# EAGLE design 8335-breakout (EAGLE 8.4.0)
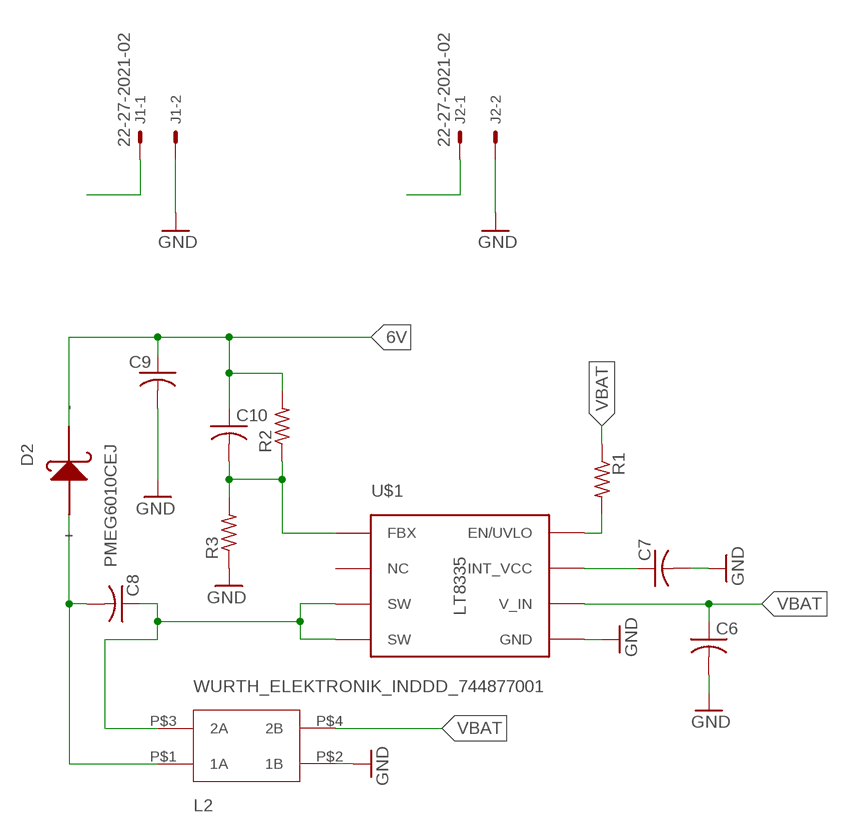
[diagram p0: schematic, sheet 1]

## Parts
C6  C-USC0805  [C0805]
C7  C-USC0805  [C0805]
C8  C-USC0805  [C0805]
C9  C-USC0805  [C0805]
C10  C-USC0805  [C0805]
D2  PMEG6010CEJ  [SC-90]
J1  22-27-2021-02  [6410-02]
J2  22-27-2021-02  [6410-02]
L2  WURTH_ELEKTRONIK_INDDD_744877001  [WURTH_ELEKTRONIK_INDDD_744877001]
R1  R-US_R0805  [R0805]
R2  R-US_R0805  [R0805]
R3  R-US_R0805  [R0805]
U$1  LT8335  [DDB]

## Nets
6V: C9.1 C10.1 D2.P$2(-) J1.1 R2.2
EN_UVLO1: R1.2 U$1.P$8(EN/UVLO)
FBX1: C10.2 R2.1 R3.2 U$1.P$1(FBX)
GND: C6.2 C7.2 C9.2 J1.2 J2.2 L2.P$2(1B) R3.1 U$1.GND U$1.P$5(GND)
INT_VCC1: C7.1 U$1.P$7(INT_VCC)
N$1: C8.2 D2.P$1(+) L2.P$1(1A)
SW1: C8.1 L2.P$3(2A) U$1.P$3(SW) U$1.P$4(SW)
VBAT: C6.1 J2.1 L2.P$4(2B) R1.1 U$1.P$6(V_IN)
Unconnected: U$1.P$2(NC)

## Library data of the parts
C6-C10 = rcl:C-US: CAPACITOR, American symbol
D2 = DubSat1 Components:PMEG6010CEJ
J1 J2 = con-molex:22-?-02: CONNECTOR wire to board 2.54 mm (.1 inch) pitch header; OC_FARNELL: unknown; OC_NEWARK: unknown
L2 = DubSat1 Components:WURTH_ELEKTRONIK_INDDD_744877001
R1-R3 = rcl:R-US_: RESISTOR, American symbol
U$1 = DubSat1 Components:LT8335

## Net classes
0 default: width 0.254 mm, drill 0.254 mm, clearance 0.152 mm

## Board
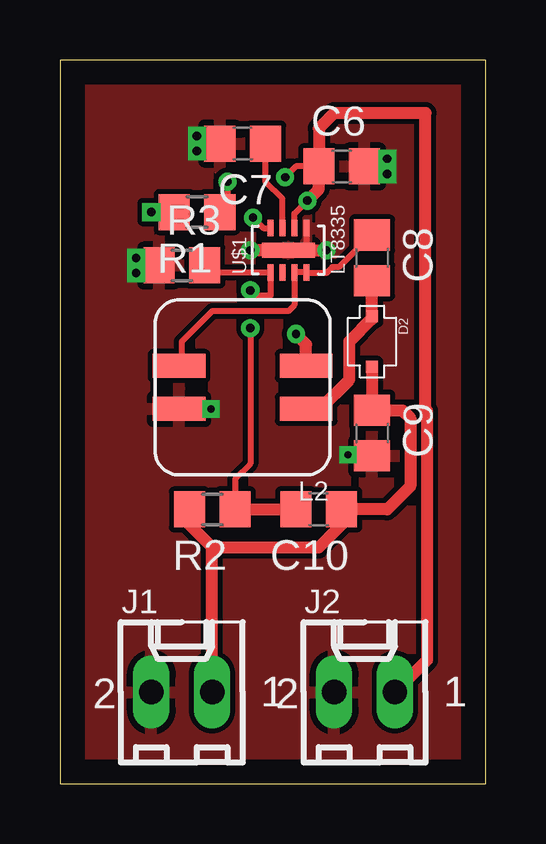
[diagram p1: board, top side]
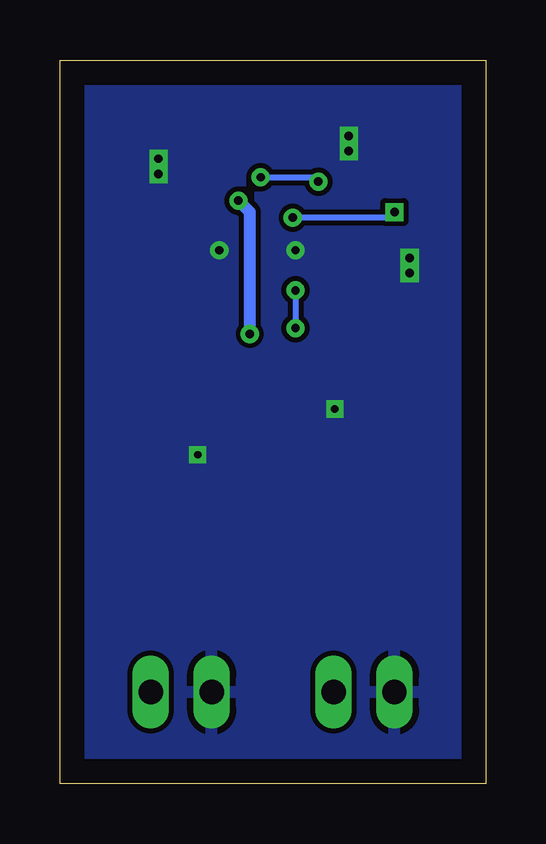
[diagram p2: board, bottom side, seen from below]

Size 17.76 x 30.15 mm. Coordinates in mm from the lower left corner, seen from the top.
Outline: 0,0 17.76,0 17.76,30.15 0,30.15 0,0
Copper layers (1*16): Top 0.035mm / dielectric 1.5mm / Bottom 0.035mm
Design rules "default *": minimum track width 6mil, minimum drill 0.35mm, track to track 8mil, track to pad 8mil, pad to pad 8mil, via to via 8mil, smd to smd 0mil, copper to edge 40mil, drill to drill 6mil, minimum pad ring 10mil, minimum via ring 8mil, stop-mask expansion 4mil, vias tented up to drill 0mil, thermal gap 10mil

### Footprints (pad centres in the part's own frame; a part is rotated, then mirrored left to right if it is on the bottom)
C0805 = smd 1.3 x 1.5: 1 -0.95,0; 2 0.95,0
SC-90 = smd 0.5 x 0.5: P$1 -1.05,0; P$2 1.05,0
6410-02 = drill 1.016 long: 1 1.27,0; 2 -1.27,0
WURTH_ELEKTRONIK_INDDD_744877001 = smd 1 x 2.2: P$1 -0.9,-2.65; P$2 -0.9,2.65; P$3 0.9,2.65; P$4 0.9,-2.65
R0805 = smd 1.3 x 1.5: 1 -0.95,0; 2 0.95,0
DDB = smd 0.61 x 2.2: GND 0,0 | smd 0.7 x 0.25: P$1 -0.925,0.75; P$2 -0.925,0.25; P$3 -0.925,-0.25; P$4 -0.925,-0.75; P$5 0.925,-0.75; P$6 0.925,-0.25; P$7 0.925,0.25; P$8 0.925,0.75

### Placement (x,y rotation side)
C6  11.75,25.72 0 top
C7  7.62,26.67 180 top
C8  13.02,21.91 270 top
C9  13.02,14.61 270 top
C10  10.79,11.43 180 top
D2  13.02,18.41 270 top
J1  5.08,3.81 0 top
J2  12.7,3.81 0 top
L2  7.62,16.51 90 top
R1  5.71,23.81 180 top
R2  6.35,11.43 180 top
R3  5.08,21.59 0 top
U$1  9.53,22.23 90 top

### Tracks (layer width: path | path; a pad name or v marks a point on that pad's centre or on a via)
6V
  Top 0.508: D2.P$2 C9.1 14.29,15.55 14.61,15.24 14.61,12.38 13.65,11.43 C10.1 11.75,10.79 10.79,9.84 6.35,9.84 | R2.2 5.4,10.79 6.35,9.84 | J1.1 6.35,9.84
EN_UVLO1  (via drill 0.35)
  Top 0.254: R1.2 v3.81,23.81 | v8.05,23.58 8.49,23.15 U$1.P$8
  Bottom 0.254: v3.81,23.81 4.04,23.58 v8.05,23.58
FBX1  (via drill 0.35)
  Top 0.254: R3.2 6.32,21.3 U$1.P$1 8.78,20.32 8.17,20.32 v7.94,20.55 | v7.94,18.98 7.94,13.34 7.3,12.7 R2.1
  Top 0.508: C10.2 R2.1
  Bottom 0.254: v7.94,20.55 v7.94,18.98
GND  (via drill 0.3, 0.35)
  Top 0.254: U$1.P$5 10.28,22.34 10.16,22.23 U$1.GND | L2.P$2 v6.3,15.61 | v3.18,21.91 3.49,21.59 | v3.18,21.27 3.49,21.59 | 3.49,21.59 R3.1 | v13.65,26.03 13.02,26.03 C6.2 13.02,25.4 v13.65,25.4 | v5.71,26.35 6.35,26.35 6.51,26.51 | 6.51,26.51 C7.2 | v5.71,26.99 6.03,26.99 6.51,26.51
  Top 0.508: v7.94,22.23 U$1.GND v11.11,22.23 | v12.01,13.7 12.97,13.7 C9.2
  pour Top: 0,0 17.78,0 17.78,30.48 0,30.48
  pour Bottom: 0,0 17.78,0 17.78,30.48 0,30.48
INT_VCC1
  Top 0.254: U$1.P$7 9.28,24.38 8.57,25.08 C7.1
N$1
  Top 0.508: C8.2 D2.P$1 13.02,19.37 12.07,18.41 12.07,16.83 10.85,15.61 L2.P$1
SW1
  Top 0.254: L2.P$3 5.08,17.52 5.08,18.41 6.35,19.69 9.53,19.69 9.78,19.94 U$1.P$3 U$1.P$4 10.3,21.27 11.11,21.27 11.36,21.52 11.63,21.52 12.97,22.86 C8.1
VBAT  (via drill 0.35)
  Top 0.254: U$1.P$6 9.78,23.74 v10.32,24.29 | R1.1 6.99,23.81 | R1.1 | C6.1 9.84,25.72 v9.39,25.27 | v6.99,25.08 6.99,24.13 R1.1
  Top 0.508: v10.32,24.29 10.8,24.77 C6.1 10.79,27.3 11.43,27.94 15.24,27.94 15.24,15.61 15.32,15.54 15.32,5.16 J2.1 | L2.P$4 10.27,18.3 v9.84,18.73
  Bottom 0.254: v9.39,25.27 7.17,25.27 v6.99,25.08
  Bottom 0.508: v9.84,18.73 9.84,23.81 v10.32,24.29